# EAGLE board STM32F446 front pane - south - v3 (EAGLE 9.6.2), part 1 of 2
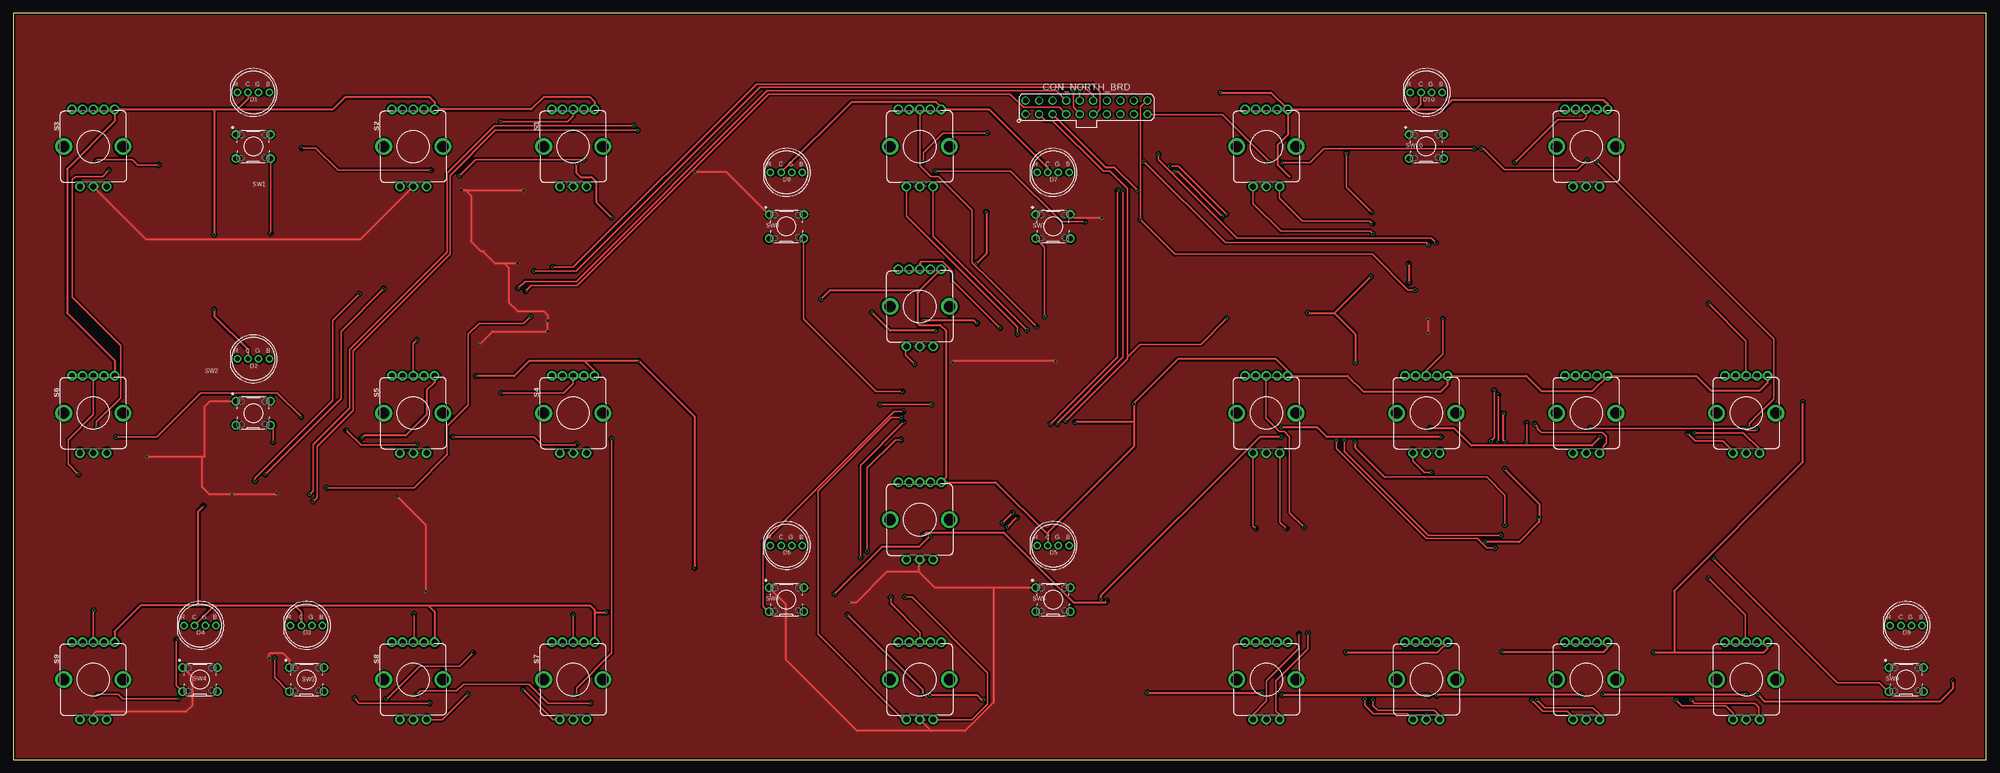
[diagram p9: board, top side]
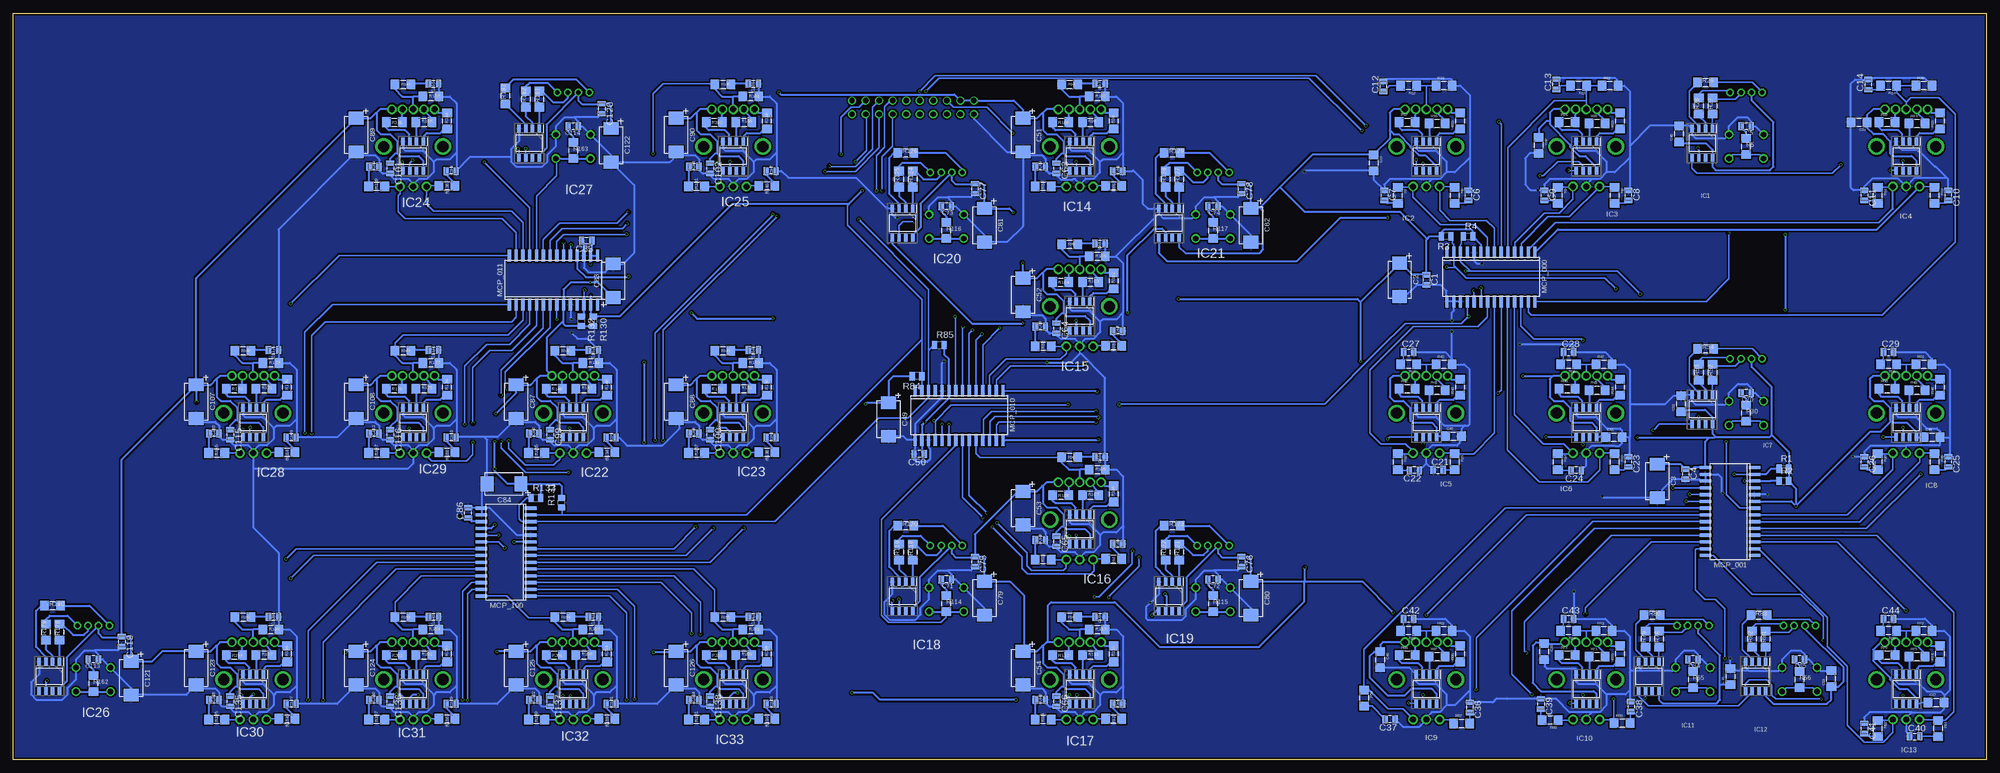
[diagram p10: board, bottom side, seen from below]

Size 370 x 140 mm. Coordinates in mm from the lower left corner, seen from the top.
Outline: 0,0 370,0 370,140 0,140 0,0
Copper layers (1*16): Top 0.035559375mm / dielectric 1.6mm / Bottom 0.035559375mm
Design rules "jlcpcb2layer": minimum track width 5mil, minimum drill 12mil, track to track 5mil, track to pad 5mil, pad to pad 5mil, via to via 5mil, smd to smd 5mil, copper to edge 8mil, drill to drill 6mil, minimum pad ring 5mil, minimum via ring 3mil, stop-mask expansion 2.5mil, vias tented up to drill 0mil, thermal gap 10mil

## Footprints (pad centres in the part's own frame; a part is rotated, then mirrored left to right if it is on the bottom)
0805-CAP = smd 1 x 1.5: 1 -0.95,0; 2 0.95,0
CPOL2917 = smd 2.4 x 2.8: + -3.15,0; - 3.15,0
1206 = smd 1.6 x 1.8: 1 -1.5,0; 2 1.5,0
MA10-2 = drill 1.016: 1 -11.43,-1.27; 2 -11.43,1.27; 3 -8.89,-1.27; 4 -8.89,1.27; 5 -6.35,-1.27; 6 -6.35,1.27; 7 -3.81,-1.27; 8 -3.81,1.27; 9 -1.27,-1.27; 10 -1.27,1.27; 11 1.27,-1.27; 12 1.27,1.27; 13 3.81,-1.27; 14 3.81,1.27; 15 6.35,-1.27; 16 6.35,1.27; 17 8.89,-1.27; 18 8.89,1.27; 19 11.43,-1.27; 20 11.43,1.27
LED4-2.0-D8.0MM = drill 0.85 pad 1.4: 1 3,0; 2 1,0; 3 -1,0; 4 -3,0
SOIC127P600X175-8N = smd 1.528 x 0.65: 1 -2.711,1.905; 2 -2.711,0.635; 3 -2.711,-0.635; 4 -2.711,-1.905; 5 2.711,-1.905; 6 2.711,-0.635; 7 2.711,0.635; 8 2.711,1.905
SOIC-28 = smd 2.2 x 0.6: 1 -4.6,8.255; 2 -4.6,6.985; 3 -4.6,5.715; 4 -4.6,4.445; 5 -4.6,3.175; 6 -4.6,1.905; 7 -4.6,0.635; 8 -4.6,-0.635; 9 -4.6,-1.905; 10 -4.6,-3.175; 11 -4.6,-4.445; 12 -4.6,-5.715; 13 -4.6,-6.985; 14 -4.6,-8.255; 15 4.6,-8.255; 16 4.6,-6.985; 17 4.6,-5.715; 18 4.6,-4.445; 19 4.6,-3.175; 20 4.6,-1.905; 21 4.6,-0.635; 22 4.6,0.635; 23 4.6,1.905; 24 4.6,3.175; 25 4.6,4.445; 26 4.6,5.715; 27 4.6,6.985; 28 4.6,8.255
R0805 = smd 1.016 x 1.422: 1 -0.889,0; 2 0.889,0
ENCODER_LED_3 = drill 1.1 pad 1.778: 1 -4,7; 2 -2,7; 3 0,7; 4 2,7; 5 4,7 | drill 1.1 pad 1.8: A -2.5,-7.5; B 2.5,-7.5; C 0,-7.5 | drill 2.1: M1 -5.55,0; M2 5.55,0
B3F-1000 = drill 1 pad 1.6: 1 -3.25,2.25; 2 3.25,2.25; 3 -3.25,-2.25; 4 3.25,-2.25

## Placement (x,y rotation side)
C1  100n  [0805-CAP]  105,90 270 bottom
C2  10u  [CPOL2917]  110,90 270 bottom
C3  10u  [CPOL2917]  61.69,52.26 270 bottom
C4  100n  [0805-CAP]  56.4,53.53 270 bottom
C5  10n  [0805-CAP]  45,118.81 180 bottom
C6  10n  [0805-CAP]  97.13,105.86 270 bottom
C7  10n  [0805-CAP]  112.87,105.86 270 bottom
C8  10n  [0805-CAP]  67.13,105.86 270 bottom
C9  10n  [0805-CAP]  82.87,105.86 270 bottom
C10  10n  [0805-CAP]  7.13,105.86 270 bottom
C11  10n  [0805-CAP]  22.87,105.86 270 bottom
C12  10n  [0805-CAP]  113.02,126.29 90 bottom
C13  10n  [0805-CAP]  80.63,126.7 90 bottom
C14  10n  [0805-CAP]  22.08,126.63 90 bottom
C15  100n  [1206]  47.98,15.55 90 bottom
C16  100n  [1206]  82.9,20.25 270 bottom
C17  100n  [1206]  9.37,10.72 0 bottom
C18  100n  [1206]  29.05,15.16 90 bottom
C19  100n  [1206]  114.91,111.94 270 bottom
C20  10n  [0805-CAP]  45,68.81 180 bottom
C21  10n  [0805-CAP]  102.77,54.28 0 bottom
C22  10n  [0805-CAP]  107.24,54.28 180 bottom
C23  10n  [0805-CAP]  67.13,55.86 270 bottom
C24  10n  [0805-CAP]  76.88,54.25 180 bottom
C25  10n  [0805-CAP]  7.13,55.86 270 bottom
C26  10n  [0805-CAP]  22.87,55.86 270 bottom
C27  10n  [0805-CAP]  108.3,76.43 0 bottom
C28  10n  [0805-CAP]  78.3,76.43 0 bottom
C29  10n  [0805-CAP]  18.3,76.43 0 bottom
C30  100n  [1206]  99.92,60.63 0 bottom
C31  100n  [1206]  69.82,60.5 0 bottom
C32  100n  [1206]  57.25,66.73 90 bottom
C33  100n  [1206]  23.85,119.56 180 bottom
C34  10n  [0805-CAP]  55,18.81 180 bottom
C35  10n  [0805-CAP]  35,18.81 180 bottom
C36  10n  [0805-CAP]  96.87,9.79 270 bottom
C37  10n  [0805-CAP]  111.77,7.54 180 bottom
C38  10n  [0805-CAP]  66.62,9.92 270 bottom
C39  10n  [0805-CAP]  83.51,10.43 270 bottom
C40  10n  [0805-CAP]  13.4,4.33 0 bottom
C41  10n  [0805-CAP]  22.87,5.86 270 bottom
C42  10n  [0805-CAP]  108.3,26.43 0 bottom
C43  10n  [0805-CAP]  78.3,26.43 0 bottom
C44  10n  [0805-CAP]  18.3,26.43 0 bottom
C45  100n  [1206]  113.64,18.72 270 bottom
C46  100n  [1206]  57.63,117.4 90 bottom
C47  100n  [1206]  83.92,115.24 270 bottom
C48  100n  [1206]  10.13,60.5 0 bottom
C49  10u  [CPOL2917]  205.84,63.81 270 bottom
C50  100n  [0805-CAP]  200.12,57.33 180 bottom
C51  10u  [CPOL2917]  180.67,117.16 270 bottom
C52  10u  [CPOL2917]  180.67,87.16 270 bottom
C53  10u  [CPOL2917]  180.67,47.16 270 bottom
C54  10u  [CPOL2917]  180.67,17.16 270 bottom
C55  10n  [0805-CAP]  162.89,110.43 180 bottom
C56  10n  [0805-CAP]  177.37,111.19 180 bottom
C57  10n  [0805-CAP]  162.89,80.43 180 bottom
C58  10n  [0805-CAP]  177.37,81.19 180 bottom
C59  10n  [0805-CAP]  162.89,40.43 180 bottom
C60  10n  [0805-CAP]  177.37,41.19 180 bottom
C61  10n  [0805-CAP]  162.89,10.43 180 bottom
C62  10n  [0805-CAP]  177.37,11.19 180 bottom
C63  100n  [0805-CAP]  174.32,110.94 270 bottom
C64  100n  [0805-CAP]  174.32,80.94 270 bottom
C65  100n  [0805-CAP]  174.32,40.94 270 bottom
C66  100n  [0805-CAP]  174.32,10.94 270 bottom
C67  10n  [0805-CAP]  166.19,126.81 0 bottom
C68  10n  [0805-CAP]  166.19,96.81 0 bottom
C69  10n  [0805-CAP]  166.19,56.81 0 bottom
C70  10n  [0805-CAP]  166.19,26.81 0 bottom
C71  10n  [0805-CAP]  195,33.81 180 bottom
C72  10n  [0805-CAP]  145,33.81 180 bottom
C73  10n  [0805-CAP]  195,103.81 180 bottom
C74  10n  [0805-CAP]  145,103.81 180 bottom
C75  100n  [0805-CAP]  189.67,37.11 270 bottom
C76  100n  [0805-CAP]  139.67,37.11 270 bottom
C77  100n  [0805-CAP]  189.67,107.11 270 bottom
C78  100n  [0805-CAP]  139.67,107.11 270 bottom
C79  10u  [CPOL2917]  187.89,30.25 270 bottom
C80  10u  [CPOL2917]  137.89,30.25 270 bottom
C81  10u  [CPOL2917]  187.89,100.25 270 bottom
C82  10u  [CPOL2917]  137.89,100.25 270 bottom
C83  10u  [CPOL2917]  257.53,89.84 90 bottom
C84  10u  [CPOL2917]  277.98,51.74 180 bottom
C85  100n  [0805-CAP]  262.48,97.33 180 bottom
C86  100n  [0805-CAP]  284.71,46.28 90 bottom
C87  10u  [CPOL2917]  275.67,67.16 270 bottom
C88  10u  [CPOL2917]  245.67,67.16 270 bottom
C89  10u  [CPOL2917]  305.67,117.16 270 bottom
C90  10u  [CPOL2917]  245.67,117.16 270 bottom
C91  10n  [0805-CAP]  257.89,60.43 180 bottom
C92  10n  [0805-CAP]  272.37,61.19 180 bottom
C93  10n  [0805-CAP]  227.89,60.43 180 bottom
C94  10n  [0805-CAP]  242.37,61.19 180 bottom
C95  10n  [0805-CAP]  287.89,110.43 180 bottom
C96  10n  [0805-CAP]  302.37,111.19 180 bottom
C97  10n  [0805-CAP]  227.89,110.43 180 bottom
C98  10n  [0805-CAP]  242.37,111.19 180 bottom
C99  100n  [0805-CAP]  269.32,60.94 270 bottom
C100  100n  [0805-CAP]  239.32,60.94 270 bottom
C101  100n  [0805-CAP]  299.32,110.94 270 bottom
C102  100n  [0805-CAP]  239.32,110.94 270 bottom
C103  10n  [0805-CAP]  261.19,76.81 0 bottom
C104  10n  [0805-CAP]  231.19,76.81 0 bottom
C105  10n  [0805-CAP]  291.19,126.81 0 bottom
C106  10n  [0805-CAP]  231.19,126.81 0 bottom
C107  10u  [CPOL2917]  335.67,67.16 270 bottom
C108  10u  [CPOL2917]  305.67,67.16 270 bottom
C109  10n  [0805-CAP]  317.89,60.43 180 bottom
C110  10n  [0805-CAP]  332.37,61.19 180 bottom
C111  10n  [0805-CAP]  287.89,60.43 180 bottom
C112  10n  [0805-CAP]  302.37,61.19 180 bottom
C113  10n  [0805-CAP]  355,18.81 180 bottom
C114  10n  [0805-CAP]  265,118.81 180 bottom
C115  100n  [0805-CAP]  329.32,60.94 270 bottom
C116  100n  [0805-CAP]  299.32,60.94 270 bottom
C117  10n  [0805-CAP]  321.19,76.81 0 bottom
C118  10n  [0805-CAP]  291.19,76.81 0 bottom
C119  100n  [0805-CAP]  349.67,22.11 270 bottom
C120  100n  [0805-CAP]  259.67,122.11 270 bottom
C121  10u  [CPOL2917]  347.89,15.25 270 bottom
C122  10u  [CPOL2917]  257.89,115.25 270 bottom
C123  10u  [CPOL2917]  335.67,17.16 270 bottom
C124  10u  [CPOL2917]  305.67,17.16 270 bottom
C125  10u  [CPOL2917]  275.67,17.16 270 bottom
C126  10u  [CPOL2917]  245.67,17.16 270 bottom
C127  10n  [0805-CAP]  317.89,10.43 180 bottom
C128  10n  [0805-CAP]  332.37,11.19 180 bottom
C129  10n  [0805-CAP]  287.89,10.43 180 bottom
C130  10n  [0805-CAP]  302.37,11.19 180 bottom
C131  10n  [0805-CAP]  257.89,10.43 180 bottom
C132  10n  [0805-CAP]  272.37,11.19 180 bottom
C133  10n  [0805-CAP]  227.89,10.43 180 bottom
C134  10n  [0805-CAP]  242.37,11.19 180 bottom
C135  100n  [0805-CAP]  329.32,10.94 270 bottom
C136  100n  [0805-CAP]  299.32,10.94 270 bottom
C137  100n  [0805-CAP]  269.32,10.94 270 bottom
C138  100n  [0805-CAP]  239.32,10.94 270 bottom
C139  10n  [0805-CAP]  321.19,26.81 0 bottom
C140  10n  [0805-CAP]  291.19,26.81 0 bottom
C141  10n  [0805-CAP]  261.19,26.81 0 bottom
C142  10n  [0805-CAP]  231.19,26.81 0 bottom
CON_NORTH_BRD  [MA10-2]  201.27,122.35 0 top
D1  CZXR-80RGB03-A  [LED4-2.0-D8.0MM]  45,125.16 180 top
D2  CZXR-80RGB03-A  [LED4-2.0-D8.0MM]  45,75.16 180 top
D3  CZXR-80RGB03-A  [LED4-2.0-D8.0MM]  55,25.16 180 top
D4  CZXR-80RGB03-A  [LED4-2.0-D8.0MM]  35,25.16 180 top
D5  CZXR-80RGB03-A  [LED4-2.0-D8.0MM]  195,40.16 180 top
D6  CZXR-80RGB03-A  [LED4-2.0-D8.0MM]  145,40.16 180 top
D7  CZXR-80RGB03-A  [LED4-2.0-D8.0MM]  195,110.16 180 top
D8  CZXR-80RGB03-A  [LED4-2.0-D8.0MM]  145,110.16 180 top
D9  CZXR-80RGB03-A  [LED4-2.0-D8.0MM]  355,25.16 180 top
D10  CZXR-80RGB03-A  [LED4-2.0-D8.0MM]  265,125.16 180 top
IC1  NEOPIXEL-TLC59731DR  [SOIC127P600X175-8N]  53.26,115.64 270 bottom
IC2  NEOPIXEL-TLC59731DR  [SOIC127P600X175-8N]  105,113.22 270 bottom
IC3  NEOPIXEL-TLC59731DR  [SOIC127P600X175-8N]  75,113.22 270 bottom
IC4  NEOPIXEL-TLC59731DR  [SOIC127P600X175-8N]  15,113.22 270 bottom
IC5  NEOPIXEL-TLC59731DR  [SOIC127P600X175-8N]  105,63.22 270 bottom
IC6  NEOPIXEL-TLC59731DR  [SOIC127P600X175-8N]  75,63.22 270 bottom
IC7  NEOPIXEL-TLC59731DR  [SOIC127P600X175-8N]  53.26,65.64 270 bottom
IC8  NEOPIXEL-TLC59731DR  [SOIC127P600X175-8N]  15,63.22 270 bottom
IC9  NEOPIXEL-TLC59731DR  [SOIC127P600X175-8N]  105,13.22 270 bottom
IC10  NEOPIXEL-TLC59731DR  [SOIC127P600X175-8N]  75,13.22 270 bottom
IC11  NEOPIXEL-TLC59731DR  [SOIC127P600X175-8N]  63.26,15.63 270 bottom
IC12  NEOPIXEL-TLC59731DR  [SOIC127P600X175-8N]  43.26,15.63 270 bottom
IC13  NEOPIXEL-TLC59731DR  [SOIC127P600X175-8N]  15,13.22 270 bottom
IC14  NEOPIXEL-TLC59731DR  [SOIC127P600X175-8N]  170,113.22 270 bottom
IC15  NEOPIXEL-TLC59731DR  [SOIC127P600X175-8N]  170,83.22 270 bottom
IC16  NEOPIXEL-TLC59731DR  [SOIC127P600X175-8N]  170,43.22 270 bottom
IC17  NEOPIXEL-TLC59731DR  [SOIC127P600X175-8N]  170,13.22 270 bottom
IC18  NEOPIXEL-TLC59731DR  [SOIC127P600X175-8N]  203.25,30.64 270 bottom
IC19  NEOPIXEL-TLC59731DR  [SOIC127P600X175-8N]  153.25,30.64 270 bottom
IC20  NEOPIXEL-TLC59731DR  [SOIC127P600X175-8N]  203.25,100.64 270 bottom
IC21  NEOPIXEL-TLC59731DR  [SOIC127P600X175-8N]  153.25,100.64 270 bottom
IC22  NEOPIXEL-TLC59731DR  [SOIC127P600X175-8N]  265,63.22 270 bottom
IC23  NEOPIXEL-TLC59731DR  [SOIC127P600X175-8N]  235,63.22 270 bottom
IC24  NEOPIXEL-TLC59731DR  [SOIC127P600X175-8N]  295,113.22 270 bottom
IC25  NEOPIXEL-TLC59731DR  [SOIC127P600X175-8N]  235,113.22 270 bottom
IC26  NEOPIXEL-TLC59731DR  [SOIC127P600X175-8N]  363.25,15.63 270 bottom
IC27  NEOPIXEL-TLC59731DR  [SOIC127P600X175-8N]  273.25,115.64 270 bottom
IC28  NEOPIXEL-TLC59731DR  [SOIC127P600X175-8N]  325,63.22 270 bottom
IC29  NEOPIXEL-TLC59731DR  [SOIC127P600X175-8N]  295,63.22 270 bottom
IC30  NEOPIXEL-TLC59731DR  [SOIC127P600X175-8N]  325,13.22 270 bottom
IC31  NEOPIXEL-TLC59731DR  [SOIC127P600X175-8N]  295,13.22 270 bottom
IC32  NEOPIXEL-TLC59731DR  [SOIC127P600X175-8N]  265,13.22 270 bottom
IC33  NEOPIXEL-TLC59731DR  [SOIC127P600X175-8N]  235,13.22 270 bottom
MCP_000  MCP23017  [SOIC-28]  92.87,90.54 270 bottom
MCP_001  MCP23017  [SOIC-28]  48.05,46.52 180 bottom
MCP_010  MCP23017  [SOIC-28]  192.63,64.57 270 bottom
MCP_011  MCP23017  [SOIC-28]  268.7,89.97 90 bottom
MCP_100  MCP23017  [SOIC-28]  277.59,38.91 180 bottom
R1  1k  [R0805]  37.95,54.53 0 bottom
R2  1k  [R0805]  37.95,52.25 0 bottom
R3  1k  [R0805]  101.25,98.16 180 bottom
R4  1k  [R0805]  97.19,98.16 0 bottom
R5  470  [1206]  45,115 90 bottom
R6  470  [1206]  99.67,105.86 270 bottom
R7  470  [1206]  110.33,105.86 270 bottom
R8  470  [1206]  69.67,105.86 270 bottom
R9  470  [1206]  80.33,105.86 270 bottom
R10  470  [1206]  9.67,105.86 270 bottom
R11  470  [1206]  20.33,105.86 270 bottom
R12  470  [1206]  108.3,126.43 180 bottom
R13  470  [1206]  76.4,126.43 180 bottom
R14  470  [1206]  18.3,126.43 180 bottom
R15  100  [1206]  98.65,119.83 90 bottom
R16  100  [1206]  102.97,119.32 0 bottom
R17  100  [1206]  108.56,119.57 0 bottom
R18  10k  [1206]  101.7,126.43 0 bottom
R19  100  [1206]  68.65,119.83 90 bottom
R20  100  [1206]  72.97,119.32 0 bottom
R21  100  [1206]  78.56,119.57 0 bottom
R22  10k  [1206]  70.56,126.43 0 bottom
R23  100  [1206]  8.65,119.83 90 bottom
R24  100  [1206]  12.97,119.32 0 bottom
R25  100  [1206]  18.56,119.57 0 bottom
R26  10k  [1206]  11.7,126.43 0 bottom
R27  100  [1206]  51.35,122.62 90 bottom
R28  100  [1206]  53.89,122.62 90 bottom
R29  100  [1206]  52.62,127.06 0 bottom
R30  470  [1206]  45,65 90 bottom
R31  470  [1206]  99.67,55.86 270 bottom
R32  470  [1206]  110.33,55.86 270 bottom
R33  470  [1206]  69.67,55.86 270 bottom
R34  470  [1206]  80.33,55.86 270 bottom
R35  470  [1206]  9.67,55.86 270 bottom
R36  470  [1206]  20.33,55.86 270 bottom
R37  470  [1206]  108.3,74.14 180 bottom
R38  470  [1206]  78.3,74.14 180 bottom
R39  470  [1206]  18.3,74.14 180 bottom
R40  100  [1206]  98.65,69.83 90 bottom
R41  100  [1206]  102.97,69.32 0 bottom
R42  100  [1206]  108.56,69.57 0 bottom
R43  10k  [1206]  101.7,74.14 0 bottom
R44  100  [1206]  68.65,69.83 90 bottom
R45  100  [1206]  72.97,69.32 0 bottom
R46  100  [1206]  78.56,69.57 0 bottom
R47  10k  [1206]  71.7,74.14 0 bottom
R48  100  [1206]  8.65,69.83 90 bottom
R49  100  [1206]  12.97,69.32 0 bottom
R50  100  [1206]  18.56,69.57 0 bottom
R51  10k  [1206]  11.7,74.14 0 bottom
R52  100  [1206]  51.35,72.62 90 bottom
R53  100  [1206]  53.89,72.62 90 bottom
R54  100  [1206]  52.62,77.06 0 bottom
R55  470  [1206]  55,15 90 bottom
R56  470  [1206]  35,15 90 bottom
R57  470  [1206]  98.36,6.78 0 bottom
R58  470  [1206]  116.68,11.57 270 bottom
R59  470  [1206]  68.26,6.81 0 bottom
R60  470  [1206]  81.8,7.39 180 bottom
R61  470  [1206]  9.03,5.86 270 bottom
R62  470  [1206]  20.33,5.86 270 bottom
R63  470  [1206]  108.3,24.14 180 bottom
R64  470  [1206]  78.3,24.14 180 bottom
R65  470  [1206]  18.3,24.14 180 bottom
R66  100  [1206]  98.65,19.83 90 bottom
R67  100  [1206]  102.97,19.32 0 bottom
R68  100  [1206]  108.56,19.57 0 bottom
R69  10k  [1206]  101.7,24.14 0 bottom
R70  100  [1206]  68.65,19.83 90 bottom
R71  100  [1206]  72.97,19.32 0 bottom
R72  100  [1206]  78.56,19.57 0 bottom
R73  10k  [1206]  71.7,24.14 0 bottom
R74  100  [1206]  8.65,19.83 90 bottom
R75  100  [1206]  12.97,19.32 0 bottom
R76  100  [1206]  18.56,19.57 0 bottom
R77  10k  [1206]  11.7,24.14 0 bottom
R78  100  [1206]  61.35,22.62 90 bottom
R79  100  [1206]  63.89,22.62 90 bottom
R80  100  [1206]  62.62,27.07 0 bottom
R81  100  [1206]  41.35,22.62 90 bottom
R82  100  [1206]  43.89,22.62 90 bottom
R83  100  [1206]  42.62,27.07 0 bottom
R84  1k  [R0805]  200.5,71.93 180 bottom
R85  1k  [R0805]  196.31,77.78 0 bottom
R86  470  [1206]  163.65,107.63 0 bottom
R87  470  [1206]  176.86,107.51 180 bottom
R88  470  [1206]  163.65,77.63 0 bottom
R89  470  [1206]  176.86,77.51 180 bottom
R90  470  [1206]  163.65,37.63 0 bottom
R91  470  [1206]  176.86,37.51 180 bottom
R92  470  [1206]  163.65,7.63 0 bottom
R93  470  [1206]  176.86,7.51 180 bottom
R94  470  [1206]  171.91,126.68 0 bottom
R95  470  [1206]  171.91,96.68 0 bottom
R96  470  [1206]  171.91,56.68 0 bottom
R97  470  [1206]  171.91,26.68 0 bottom
R98  100  [1206]  163.65,119.83 90 bottom
R99  100  [1206]  167.97,119.57 0 bottom
R100  100  [1206]  173.56,119.57 0 bottom
R101  10k  [1206]  166.7,124.4 0 bottom
R102  100  [1206]  163.65,89.83 90 bottom
R103  100  [1206]  167.97,89.57 0 bottom
R104  100  [1206]  173.56,89.57 0 bottom
R105  10k  [1206]  166.7,94.4 0 bottom
R106  100  [1206]  163.65,49.83 90 bottom
R107  100  [1206]  167.97,49.57 0 bottom
R108  100  [1206]  173.56,49.57 0 bottom
R109  10k  [1206]  166.7,54.4 0 bottom
R110  100  [1206]  163.65,19.83 90 bottom
R111  100  [1206]  167.97,19.57 0 bottom
R112  100  [1206]  173.56,19.57 0 bottom
R113  10k  [1206]  166.7,24.4 0 bottom
R114  470  [1206]  195,29.24 90 bottom
R115  470  [1206]  145,29.24 90 bottom
R116  470  [1206]  195,99.24 90 bottom
R117  470  [1206]  145,99.24 90 bottom
R118  100  [1206]  201.35,38.89 90 bottom
R119  100  [1206]  203.89,38.89 90 bottom
R120  100  [1206]  202.62,43.84 0 bottom
R121  100  [1206]  151.35,38.89 90 bottom
R122  100  [1206]  153.89,38.89 90 bottom
R123  100  [1206]  152.62,43.84 0 bottom
R124  100  [1206]  201.35,108.89 90 bottom
R125  100  [1206]  203.89,108.89 90 bottom
R126  100  [1206]  202.62,113.84 0 bottom
R127  100  [1206]  151.35,108.89 90 bottom
R128  100  [1206]  153.89,108.89 90 bottom
R129  100  [1206]  152.62,113.84 0 bottom
R130  1k  [R0805]  261.21,82.22 270 bottom
R131  1k  [R0805]  267.18,48.19 90 bottom
R132  1k  [R0805]  263.5,82.22 270 bottom
R133  1k  [R0805]  272.01,49.07 0 bottom
R134  470  [1206]  258.65,57.63 0 bottom
R135  470  [1206]  271.86,57.51 180 bottom
R136  470  [1206]  228.65,57.63 0 bottom
R137  470  [1206]  241.86,57.51 180 bottom
R138  470  [1206]  288.65,107.63 0 bottom
R139  470  [1206]  301.86,107.51 180 bottom
R140  470  [1206]  228.65,107.63 0 bottom
R141  470  [1206]  241.86,107.51 180 bottom
R142  470  [1206]  266.9,76.68 0 bottom
R143  470  [1206]  236.91,76.68 0 bottom
R144  470  [1206]  296.9,126.68 0 bottom
R145  470  [1206]  236.91,126.68 0 bottom
R146  100  [1206]  258.65,69.83 90 bottom
R147  100  [1206]  262.97,69.57 0 bottom
R148  100  [1206]  268.56,69.57 0 bottom
R149  10k  [1206]  261.7,74.4 0 bottom
R150  100  [1206]  228.65,69.83 90 bottom
R151  100  [1206]  232.97,69.57 0 bottom
R152  100  [1206]  238.56,69.57 0 bottom
R153  10k  [1206]  231.7,74.4 0 bottom
R154  100  [1206]  288.65,119.83 90 bottom
R155  100  [1206]  292.97,119.57 0 bottom
R156  100  [1206]  298.56,119.57 0 bottom
R157  10k  [1206]  291.7,124.4 0 bottom
R158  100  [1206]  228.65,119.83 90 bottom
R159  100  [1206]  232.97,119.57 0 bottom
R160  100  [1206]  238.56,119.57 0 bottom
R161  10k  [1206]  231.7,124.4 0 bottom
R162  470  [1206]  355,14.24 90 bottom
R163  470  [1206]  265,114.24 90 bottom
R164  470  [1206]  318.65,57.63 0 bottom
R165  470  [1206]  331.86,57.51 180 bottom
R166  470  [1206]  288.65,57.63 0 bottom
R167  470  [1206]  301.86,57.51 180 bottom
R168  470  [1206]  326.9,76.68 0 bottom
R169  470  [1206]  296.9,76.68 0 bottom
R170  100  [1206]  318.65,69.83 90 bottom
R171  100  [1206]  322.97,69.57 0 bottom
R172  100  [1206]  328.56,69.57 0 bottom
R173  10k  [1206]  321.7,74.4 0 bottom
R174  100  [1206]  288.65,69.83 90 bottom
R175  100  [1206]  292.97,69.57 0 bottom
R176  100  [1206]  298.56,69.57 0 bottom
R177  10k  [1206]  291.7,74.4 0 bottom
R178  100  [1206]  361.35,23.89 90 bottom
R179  100  [1206]  363.89,23.89 90 bottom
R180  100  [1206]  362.62,28.84 0 bottom
R181  100  [1206]  271.35,123.89 90 bottom
R182  100  [1206]  273.89,123.89 90 bottom
R183  100  [1206]  277.73,124.53 90 bottom
R184  470  [1206]  318.65,7.63 0 bottom
R185  470  [1206]  331.86,7.51 180 bottom
R186  470  [1206]  288.65,7.63 0 bottom
R187  470  [1206]  301.86,7.51 180 bottom
R188  470  [1206]  258.65,7.63 0 bottom
R189  470  [1206]  271.86,7.51 180 bottom
R190  470  [1206]  228.65,7.63 0 bottom
R191  470  [1206]  241.86,7.51 180 bottom
R192  470  [1206]  326.9,26.68 0 bottom
R193  470  [1206]  296.9,26.68 0 bottom
R194  470  [1206]  266.9,26.68 0 bottom
R195  470  [1206]  236.91,26.68 0 bottom
R196  100  [1206]  318.65,19.83 90 bottom
R197  100  [1206]  322.97,19.57 0 bottom
R198  100  [1206]  328.56,19.57 0 bottom
R199  10k  [1206]  321.7,24.4 0 bottom
R200  100  [1206]  288.65,19.83 90 bottom
R201  100  [1206]  292.97,19.57 0 bottom
R202  100  [1206]  298.56,19.57 0 bottom
R203  10k  [1206]  291.7,24.4 0 bottom
R204  100  [1206]  258.65,19.83 90 bottom
R205  100  [1206]  262.97,19.57 0 bottom
R206  100  [1206]  268.56,19.57 0 bottom
R207  10k  [1206]  261.7,24.4 0 bottom
R208  100  [1206]  228.65,19.83 90 bottom
R209  100  [1206]  232.97,19.57 0 bottom
R210  100  [1206]  238.56,19.57 0 bottom
R211  10k  [1206]  231.7,24.4 0 bottom
S1  [ENCODER_LED_3]  105,115 0 top
S2  [ENCODER_LED_3]  75,115 0 top
S3  [ENCODER_LED_3]  15,115 0 top
S4  [ENCODER_LED_3]  105,65 0 top
S5  [ENCODER_LED_3]  75,65 0 top
S6  [ENCODER_LED_3]  15,65 0 top
S7  [ENCODER_LED_3]  105,15 0 top
S8  [ENCODER_LED_3]  75,15 0 top
S9  [ENCODER_LED_3]  15,15 0 top
S10  [ENCODER_LED_3]  170,115 0 top
S11  [ENCODER_LED_3]  170,85 0 top
S12  [ENCODER_LED_3]  170,45 0 top
S13  [ENCODER_LED_3]  170,15 0 top
S14  [ENCODER_LED_3]  265,65 0 top
S15  [ENCODER_LED_3]  235,65 0 top
S16  [ENCODER_LED_3]  295,115 0 top
S17  [ENCODER_LED_3]  235,115 0 top
S18  [ENCODER_LED_3]  325,65 0 top
S19  [ENCODER_LED_3]  295,65 0 top
S20  [ENCODER_LED_3]  325,15 0 top
S21  [ENCODER_LED_3]  295,15 0 top
S22  [ENCODER_LED_3]  265,15 0 top
S23  [ENCODER_LED_3]  235,15 0 top
SW1  B3F-1000  [B3F-1000]  45,115 0 top
SW2  B3F-1000  [B3F-1000]  45,65 0 top
SW3  B3F-1000  [B3F-1000]  55,15 0 top
SW4  B3F-1000  [B3F-1000]  35,15 0 top
SW5  B3F-1000  [B3F-1000]  195,30 0 top
SW6  B3F-1000  [B3F-1000]  145,30 0 top
SW7  B3F-1000  [B3F-1000]  195,100 0 top
SW8  B3F-1000  [B3F-1000]  145,100 0 top
SW9  B3F-1000  [B3F-1000]  355,15 0 top
SW10  B3F-1000  [B3F-1000]  265,115 0 top

## Tracks (layer width: path | path; a pad name or v marks a point on that pad's centre or on a via)
3V3  (via drill 0.35)
  Top 0.406: S5.5 79,70.78 77.54,69.32 77.54,64.75 73.55,60.76 65.76,60.76 v65.38,60.38 | D1.2 44,123.96 42.04,122 | 37.69,122 S3.5 19,119.72 10.08,110.8 10.08,83.8 19,74.88 S6.5 | 37.69,122 42.04,122 | 42.04,122 59.94,122 62.2,124.26 78.08,124.26 79,123.33 S2.5 97.16,122 99.41,124.26 108.18,124.26 109,123.43 S1.5 | 107.16,74.73 96.75,74.73 93.95,71.93 v86.84,71.93 | 107.16,74.73 109,72.89 S4.5 | 107.16,74.73 v117.32,74.73 127.73,64.31 v127.73,35.99 | D4.2 37.72,28.88 | D3.2 54,27.68 52.8,28.88 | 37.72,28.88 52.8,28.88 | 37.72,28.88 34.64,28.88 | 34.64,28.88 23.85,28.88 19,24.03 S9.5 | 52.8,28.88 77.82,28.88 | S8.5 79,27.7 77.82,28.88 | 77.82,28.88 108.18,28.88 109,28.06 109,27.48 | 109,27.48 S7.5 | 34.64,28.88 34.64,46.53 v35.66,47.55 | v249.91,20.12 267.12,20.12 S22.5 | v279.25,20.25 298.3,20.25 299,20.95 S21.5 | v307.69,20.12 311.5,20.12 | 311.5,20.12 328.27,20.12 329,20.85 S20.5 | S18.5 329,70.76 327.5,69.27 318.36,69.27 315.63,72 S19.5 296.14,69.14 286.61,69.14 283.75,72 S14.5 269,70.33 267.69,69.01 253.21,69.01 250.22,72 S15.5 239,72.89 236.78,75.11 218.41,75.11 210.16,66.85 v210.16,66.73 210.16,63.3 | S17.5 263.02,122 | D10.2 264,122.98 263.02,122 | 263.02,122 268.07,122 269.82,123.75 298.3,123.75 299,123.05 S16.5 | D7.2 194,110.95 182.95,122 S10.5 174,122.44 173.07,123.37 157.21,123.37 D8.2 | 194,42.24 D5.2 | 194,42.24 184.24,52 S12.5 174.89,52.89 174.89,80.48 173.83,81.54 169.86,81.54 169.56,81.85 169.56,87.56 169.98,87.98 | v182.47,102.67 182.47,94.92 v180.69,93.14 | S11.5 169.98,87.98 | S17.5 239,117.19 237.21,115.4 237.21,111.55 239.37,109.39 | v335.63,67.11 335.63,55.8 311.5,31.68 311.5,20.12
  Top 0.406: 210.16,63.3 210.16,58.73 194,42.57 194,42.24 | v261.78,89.52 261.78,92.95 v261.72,93.02 | v279.75,54.53 279.75,54.41 286.23,47.93 v286.23,45.39 286.23,44.63 282.42,40.82 v276.07,40.82 | v279.75,59.62 279.5,59.87 v279.5,64.95 | 210.16,63.3 v199.11,63.3 | v226.41,125.15 235.85,125.15 S17.5 | v111.22,27.61 111.1,27.48 109,27.48 | 37.69,122 v37.69,98.48 | v37.69,84.38 37.69,83.24 44,76.93 D2.2 | 169.98,87.98 153.05,87.98 v151.48,86.41
  Bottom 0.406: MCP_000.9 94.77,96.64 R4.2 96.3,99.18 96.53,99.41 101.66,99.41 102.14,98.92 R3.2 104.3,98.16 104.81,97.65 | S3.5 21.21,122 22.35,120.86 C33.1 22.35,118.54 21.1,117.29 19.32,117.29 18.05,116.02 18.05,113.73 17.54,113.22 13.98,113.22 13.1,112.33 IC4.8 | S2.5 81.21,122 81.86,121.35 81.86,119.81 | S1.5 111.21,122 111.86,121.35 111.86,118.05 | 111.86,118.05 111.1,117.29 110.17,117.29 108.05,115.17 108.05,115.01 106.39,113.35 105.14,113.35 103.09,111.31 IC2.8 | S6.5 21.21,72 21.86,71.35 21.86,68.05 21.1,67.29 19.32,67.29 18.05,66.02 18.05,63.73 17.79,63.48 | 17.79,63.48 17.54,63.22 14.88,63.22 13.1,61.43 IC8.8 11.64,60.51 C48.1 | S5.5 81.21,72 81.45,71.75 | 81.45,71.75 81.86,71.35 81.86,68.05 81.1,67.29 79.32,67.29 78.05,66.02 78.05,63.73 77.54,63.22 73.98,63.22 73.09,62.33 IC6.8 71.33,60.51 C31.1 | S4.5 111.21,72 111.86,71.35 111.86,68.05 111.1,67.29 109.32,67.29 108.05,66.02 108.05,63.73 107.54,63.22 103.98,63.22 103.09,62.33 IC5.8 102.97,60.63 C30.1 | IC10.8 73.09,12.33 73.6,12.84 83.51,12.84 85.03,14.37 85.03,21.35 84.38,22 83.16,22 C16.1 79.25,21.75 S8.5 | IC9.8 103.09,12.33 103.98,13.22 107.83,13.22 109.06,11.99 112.24,11.99 115.54,15.29 115.54,19.48 114.78,20.25 113.66,20.25 C45.1 113.64,21.52 113.15,22 S7.5 | D1.2 44,123.64 39.92,119.56 39.92,111.19 40.55,110.56 50.72,110.56 51.35,111.19 IC1.8 51.35,114.42 52.55,115.62 57.35,115.62 C46.1 | D2.2 44,73.64 40.23,69.86 40.23,60.88 | 50.72,60.55 51.35,61.19 IC7.8 51.35,64.26 52.7,65.61 56.87,65.61 C32.1 | 50.72,60.55 40.55,60.55 40.23,60.88 | D3.2 54,23.64 49.92,19.55 49.92,13.89
  Bottom 0.406: 61.35,13.36 IC11.8 61.35,11.19 60.72,10.55 50.55,10.55 49.92,11.19 49.92,13.89 | D4.2 34,24.52 26.75,17.27 26.75,14.66 27.74,13.66 C18.1 29.05,11.22 29.85,10.43 39.92,10.43 41.35,11.86 IC12.8 41.35,13.36 | 104.81,97.65 105,97.46 C1.1 107.6,90.95 109.8,93.15 C2.+ 117.32,85.83 | v65.38,60.38 51.91,60.38 | 51.91,60.38 50.89,60.38 50.72,60.55 | C15.1 49.77,14.05 49.92,13.89 | 51.91,60.38 52.65,59.64 MCP_001.15 54.84,54.78 55.15,54.48 C4.1 57.33,55.41 C3.+ | 17.79,63.48 19.75,61.52 21.69,61.52 v35.66,47.55 | v86.84,71.93 81.63,71.93 81.45,71.75 | C17.1 12.16,10.72 12.37,10.51 IC13.8 13.1,11.56 14.76,13.22 16.26,13.22 18.05,15.01 18.05,15.4 21.19,18.54 21.19,20.61 19.8,22 S9.5 | C47.1 83.79,116.87 83.79,118.42 82.39,119.81 81.86,119.81 | 111.86,118.05 111.86,116.49 C19.1 126.36,113.44 132.43,107.37 | S10.5 176.21,122 176.86,121.35 | 176.86,121.35 176.86,118.05 176.1,117.29 174.32,117.29 173.05,116.02 173.05,113.73 | 173.05,113.73 172.54,113.22 168.98,113.22 168.09,112.33 IC14.8 | C63.1 174.32,112.71 173.3,113.73 173.05,113.73 | 176.86,121.35 176.99,121.35 178.03,120.31 C51.+ 180.67,121.95 182.34,123.62 CON_NORTH_BRD.2 CON_NORTH_BRD.4 193.52,124.77 199.77,124.77 199.82,124.72 225.98,124.72 v226.41,125.15 | S11.5 176.21,92 176.86,91.35 | 176.86,91.35 176.86,88.05 176.1,87.29 174.32,87.29 173.05,86.02 173.05,83.73 | 173.05,83.73 172.54,83.22 168.98,83.22 168.09,82.33 IC15.8 | C64.1 174.32,82.71 173.3,83.73 173.05,83.73 | 176.86,91.35 176.99,91.35 178.03,90.31 C52.+ 180.69,90.33 v180.69,93.14 | S12.5 176.21,52 176.86,51.35 | 176.86,51.35 176.86,48.05 176.1,47.29 174.32,47.29 173.05,46.02 173.05,43.73
  Bottom 0.406: 173.05,43.73 172.54,43.22 168.98,43.22 168.09,42.33 IC16.8 | C65.1 174.32,42.71 173.3,43.73 173.05,43.73 | 176.86,51.35 176.99,51.35 178.03,50.31 C53.+ 181.62,50.31 189.67,42.26 C75.1 | S13.5 176.21,22 | 176.86,21.35 176.86,18.05 176.1,17.29 174.32,17.29 173.05,16.02 173.05,13.73 | 173.05,13.73 172.54,13.22 168.98,13.22 168.09,12.33 IC17.8 | 176.86,21.35 176.21,22 | C66.1 174.32,12.71 173.3,13.73 173.05,13.73 | C54.+ 180.44,20.31 | 180.44,20.31 178.03,20.31 176.99,21.35 176.86,21.35 | S17.5 241.21,122 241.86,121.35 | 241.86,121.35 241.86,118.05 241.1,117.29 239.32,117.29 238.05,116.02 238.05,113.73 | 238.05,113.73 237.54,113.22 233.98,113.22 233.09,112.33 IC25.8 | C102.1 239.32,112.71 238.3,113.73 238.05,113.73 | C90.+ 243.03,120.31 241.99,121.35 241.86,121.35 | S16.5 301.21,122 301.86,121.35 | 301.86,121.35 301.86,118.05 301.1,117.29 299.32,117.29 298.05,116.02 298.05,113.73 | 298.05,113.73 297.54,113.22 293.98,113.22 293.1,112.33 IC24.8 | C101.1 299.32,112.71 298.3,113.73 298.05,113.73 | 301.86,121.35 301.99,121.35 303.03,120.31 C89.+ 335.67,90.31 C107.+ | S15.5 241.21,72 241.86,71.35 | 241.86,71.35 241.86,68.05 241.1,67.29 239.32,67.29 238.05,66.02 238.05,63.73 | 238.05,63.73 237.54,63.22 233.98,63.22 233.09,62.33 IC23.8 | C100.1 239.32,62.71 238.3,63.73 238.05,63.73 | C88.+ 243.03,70.31 241.99,71.35 241.86,71.35 | 271.86,71.35 271.86,68.05 271.1,67.29 269.32,67.29 268.05,66.02 268.05,63.73 | 268.05,63.73 267.54,63.22 263.98,63.22 263.1,62.33 IC22.8 | 271.86,71.35 271.21,72 S14.5 269.97,72.97 269.97,79.17 266.8,82.35 | C99.1 269.32,62.71 268.3,63.73 268.05,63.73
  Bottom 0.406: 271.86,71.35 271.99,71.35 273.03,70.31 C87.+ 275.67,68.78 v279.5,64.95 | S19.5 301.21,72 301.86,71.35 | 301.86,71.35 301.86,68.05 301.1,67.29 299.32,67.29 298.05,66.02 298.05,63.73 | 298.05,63.73 297.54,63.22 293.98,63.22 293.1,62.33 IC29.8 | C108.+ 303.03,70.31 301.99,71.35 301.86,71.35 | S18.5 331.21,72 331.86,71.35 | 331.86,71.35 331.86,68.05 331.1,67.29 329.32,67.29 328.05,66.02 328.05,63.73 | 328.05,63.73 327.54,63.22 323.98,63.22 323.1,62.33 IC28.8 | C115.1 329.32,62.71 328.3,63.73 328.05,63.73 | C107.+ 333.03,70.31 331.99,71.35 331.86,71.35 | S23.5 241.21,22 241.86,21.35 | 241.86,21.35 241.86,18.05 241.1,17.29 239.32,17.29 238.05,16.02 238.05,13.73 | 238.05,13.73 237.54,13.22 233.98,13.22 233.09,12.33 IC33.8 | C138.1 239.32,12.71 238.3,13.73 238.05,13.73 | 241.86,21.35 241.99,21.35 243.03,20.31 C126.+ 245.86,20.12 v249.91,20.12 | S22.5 271.21,22 271.86,21.35 | 271.86,21.35 271.86,18.05 271.1,17.29 269.32,17.29 268.05,16.02 268.05,13.73 | 268.05,13.73 267.54,13.22 263.98,13.22 263.1,12.33 IC32.8 | C137.1 269.32,12.71 268.3,13.73 268.05,13.73 | 271.86,21.35 271.99,21.35 273.03,20.31 C125.+ 279.18,20.31 v279.25,20.25 | S21.5 301.21,22 301.86,21.35 | 301.86,21.35 301.86,18.05 301.1,17.29 299.32,17.29 298.05,16.02 298.05,13.73 | 298.05,13.73 297.54,13.22 293.98,13.22 293.1,12.33 IC31.8 | C136.1 299.32,12.71 298.3,13.73 298.05,13.73 | 301.86,21.35 301.99,21.35 303.03,20.31 C124.+ 307.5,20.31 v307.69,20.12 | S20.5 331.21,22 331.86,21.35 | 331.86,21.35 331.86,18.05 331.1,17.29 329.32,17.29 328.05,16.02 328.05,13.73 | 328.05,13.73 327.54,13.22 323.98,13.22 323.1,12.33 IC30.8
  Bottom 0.406: C135.1 329.32,12.71 328.3,13.73 328.05,13.73 | 331.86,21.35 331.99,21.35 333.03,20.31 C123.+ 342.05,20.31 344.01,18.34 347.82,18.34 C121.+ 347.89,22.62 348.33,23.06 C119.1 | IC27.8 271.35,113.36 270.02,114.7 270.02,119.14 D10.2 264,123.65 263.22,122.87 259.85,122.87 C120.1 258.33,123.06 257.89,122.62 C122.+ | IC26.8 361.35,13.36 360.02,14.7 360.02,19.14 D9.2 354,23.65 353.22,22.87 349.85,22.87 C119.1 | 151.35,98.36 IC21.8 151.35,96.19 150.21,95.05 136.24,95.05 135.61,95.68 135.61,102.92 136.24,103.56 | D8.2 144,108.65 143.22,107.87 139.85,107.87 C78.1 138.33,108.06 137.89,107.62 C82.+ 137.74,103.56 136.24,103.56 | IC20.8 201.35,98.36 199.89,99.82 199.89,104.27 D7.2 194,108.65 193.22,107.87 189.85,107.87 C77.1 188.33,108.06 187.89,107.62 C81.+ 183.21,103.4 v182.47,102.67 | IC19.8 151.35,28.36 150.02,29.7 150.02,34.14 D6.2 144,38.65 143.22,37.87 139.85,37.87 C76.1 138.33,38.06 137.89,37.62 C80.+ 127.86,33.4 | IC18.8 201.35,28.36 200.02,29.7 200.02,34.14 D5.2 194,38.65 193.22,37.87 189.85,37.87 C75.1 | C75.1 188.33,38.06 187.89,37.62 C79.+ 183.06,33.4 180.44,30.79 180.44,20.31 | 132.43,107.37 136.24,103.56 | 117.32,85.83 v117.32,74.73 | C116.1 299.32,62.46 298.05,63.73 | v335.63,67.11 335.63,70.27 C107.+ | C50.1 199.62,57.77 MCP_010.16 199.62,62.79 v199.11,63.3 199.05,63.3 194.54,67.81 MCP_010.9 194.54,75.11 195.43,76 R85.2 | v210.16,66.73 209.93,66.96 C49.+ 205.84,71.05 204.95,71.93 R84.2 | 127.86,33.4 117.02,33.4 v111.22,27.61 | 176.21,22 175.99,22.21 175.99,28.88 175.36,29.52 163.42,29.52 155.04,21.13 136.37,21.13 127.86,29.64 127.86,33.4
  Bottom 0.406: v35.66,47.55 35.66,50.85 R2.2 R1.2 37.06,57.71 40.23,60.88 | MCP_001.9 36.54,48.43 v35.66,47.55 | C85.1 261.53,96 261.72,95.81 MCP_011.16 | v261.72,93.02 MCP_011.16 | R130.2 R132.2 266.42,81.33 266.8,81.71 266.8,82.35 | 257.15,86.31 C83.+ 260.36,89.52 v261.78,89.52 265.47,89.52 266.8,88.19 MCP_011.9 266.8,82.35 | v286.23,45.39 286.17,45.33 C86.1 284,44.63 MCP_100.17 | v279.75,59.62 v279.75,54.53 279.75,54.15 277.34,51.74 C84.+ 271.12,51.74 | 271.12,51.74 267.56,51.74 267.18,51.36 R131.2 | 271.12,51.74 R133.2 | MCP_100.9 v276.07,40.82 | C119.1 349.67,56.31 C107.+ | MCP_011.16 MCP_011.15 | 81.86,119.81 81.86,119.21 78.05,115.4 78.05,115.01 76.26,113.22 75.14,113.22 73.09,111.18 IC3.8 | 132.43,107.37 127.82,102.75 109.91,102.75 104.81,97.65 | v37.69,98.48 v37.69,84.38 | v127.73,35.99 127.86,35.87 127.86,33.4 | v151.48,86.41 117.9,86.41 117.32,85.83
DATA_PIXEL11  (via drill 0.35)
  Top 0.305: v17.88,110.54 16.74,109.4 11.71,109.4 11.07,108.75 11.07,86.75 20.17,77.65 20.17,67.87 15.59,63.3 v15.59,62.28
  Bottom 0.305: IC4.5 16.94,110.54 v17.88,110.54 | v15.59,62.28 15.59,60.55 IC8.6
DATA_PIXEL12  (via drill 0.35)
  Top 0.305: v27.28,111.56 23.34,111.56 22.32,112.57 15.85,112.57 v15.59,112.32
  Bottom 0.305: v15.59,112.32 15.63,112.28 IC4.6 | IC1.5 55.16,110.93 54.22,110 28.84,110 v27.28,111.56
DATA_PIXEL13  (via drill 0.35)
  Top 0.305: v78.33,110.54 60.93,110.54 56.74,114.73 v54.07,114.73
  Bottom 0.305: IC3.5 78.3,110.51 v78.33,110.54 | v54.07,114.73 54.07,114.48 53.82,114.22 53.82,112.99 IC1.6
DATA_PIXEL14  (via drill 0.35)
  Top 0.305: v83.67,109.53 86.71,112.57 v106.91,112.57
  Bottom 0.305: v106.91,112.57 IC2.5 | IC3.6 75.64,111.4 76.43,112.19 80.36,112.19 83.03,109.53 v83.67,109.53
DATA_PIXEL21  (via drill 0.35)
  Top 0.305: v19.28,60.5 26.9,60.5 35.15,68.76 49.5,68.76 v53.95,64.31
  Bottom 0.305: IC8.5 19.27,60.51 v19.28,60.5 | v53.95,64.31 53.89,64.26 IC7.6
DATA_PIXEL22  (via drill 0.35)
  Top 0.305: v62.46,61.77 65.25,58.98 75.54,58.98 v75.66,59.11
  Bottom 0.305: IC7.5 61.31,62.92 v62.46,61.77 | v75.66,59.11 75.64,59.14 IC6.6
DATA_PIXEL23  (via drill 0.35)
  Top 0.305: v82.52,60.5 97.64,60.5 99.16,58.98 105.38,58.98 v105.64,59.23
  Bottom 0.305: IC6.5 82.52,60.51 v82.52,60.5 | v105.64,59.23 IC5.6
DATA_PIXEL24  (via drill 0.35)
  Top 0.305: v112.24,60.12 112.24,19.99 105.64,13.39 v105.64,12.12
  Bottom 0.305: IC5.5 111.85,60.51 v112.24,60.12 | v105.64,12.12 IC9.6
DATA_PIXEL32  (via drill 0.35)
  Top 0.305: v30.96,11.36 20.55,11.36 19.66,12.24 15.85,12.24 v15.59,11.99
  Bottom 0.305: IC12.5 45.16,14.17 44.42,14.91 41.12,14.91 40.17,13.96 40.17,12.05 39.47,11.36 v30.96,11.36 | v15.59,11.99 15.63,11.95 IC13.6
DATA_PIXEL33
  Bottom 0.305: IC11.5 65.16,11.9 63.34,10.07 46.53,10.07 43.89,12.71 IC12.6
DATA_PIXEL34  (via drill 0.35)
  Top 0.305: v63.98,11.48 64.87,10.59 v78.08,10.59
  Bottom 0.305: IC10.5 78,10.51 v78.08,10.59 | v63.98,11.48 63.89,11.57 IC11.6
DATA_PIXEL35  (via drill 0.35)
  Top 0.305: v108.3,10.59 100.3,10.59 96.75,14.15 84.43,14.15 83.16,12.88 76.43,12.88 v75.66,12.12
  Bottom 0.305: IC9.5 106.99,10.59 v108.3,10.59 | v75.66,12.12 75.66,10.54 IC10.6
GND  (via drill 0.35)
  Top 0.406: S1.C | v49.38,49.96 49.12,49.71 v40.99,49.71 36.8,49.71 35.41,51.11 35.41,56.82 | v87.47,77.9 89.89,80.32 v100.17,80.32 v100.17,82.35 100.17,83.36 99.41,84.13 94.59,84.13 92.94,85.78 92.94,92.25 92.17,93.02 | v94.59,93.02 92.17,93.02 | 92.17,93.02 90.4,93.02 88.24,95.17 88.24,95.43 87.6,95.43 85.82,97.21 85.82,105.84 84.81,106.86 v84.05,106.86 95.6,106.86 v95.73,106.73 | SW2.1 36.94,67.25 35.91,66.22 35.91,56.82 35.41,56.82 | v24.99,56.82 35.41,56.82 | SW4.1 33.5,15.5 33.5,10.09 32.36,8.94 15.47,8.94 15,8.48 S9.C | v71.98,49.33 77.31,43.99 v77.31,31.55 | 75,107.85 S2.C 65.13,97.63 24.87,97.63 S3.C | v47.98,18.98 47.98,19.74 48.23,19.99 50.52,19.99 51.75,18.76 SW3.1 | SW5.1 183.87,32.25 | 183.87,32.25 172.88,32.25 169.9,35.23 | 169.9,35.23 169.9,37.4 S12.C | 183.87,32.25 183.87,10.72 178.53,5.38 172.12,5.38 | 172.12,5.38 S13.C | 172.12,5.38 158.22,5.38 144.88,18.72 144.88,29.12 SW6.1 | SW7.2 198.38,102.25 198.98,101.65 v204.19,101.65 | v195.43,74.73 176.38,74.73 v176.12,74.47 | 169.9,35.23 163.8,35.23 158.01,29.44 v156.74,29.44 | v127.86,110.29 133.71,110.29 SW8.1 | v265.27,82.6 v265.27,80.06
  Bottom 0.406: MCP_000.17 MCP_000.16 | MCP_000.16 MCP_000.15 101.19,86.01 101.19,87.94 102.31,89.05 C1.2 106.81,89.05 109.01,86.85 C2.- | IC3.4 76.91,114.62 76.52,114.24 73.22,114.24 71.19,112.21 71.19,110.17 | 73.98,108.9 72.46,108.9 71.19,110.17 | 73.98,108.9 75,107.89 S2.C | 66.87,115.11 66.87,125.41 67.89,126.43 R22.2 69.06,127.34 69.62,127.9 80.38,127.9 C13.2 | 66.87,115.11 66.87,112.97 | 66.87,112.97 69.67,110.17 71.19,110.17 | 66.87,112.97 66.87,107.06 C8.1 | 73.98,108.9 81.86,108.9 82.87,107.89 82.87,106.86 | 82.87,106.86 C9.1 | IC2.4 106.91,114.62 106.52,114.24 103.22,114.24 101.19,112.21 101.19,110.17 | 103.98,108.9 102.46,108.9 101.19,110.17 | 103.98,108.9 105,107.89 S1.C | 96.87,112.97 99.67,110.17 101.19,110.17 | 100.2,127.47 R18.2 98.64,126.43 96.87,124.66 96.87,112.97 | 96.87,112.97 96.87,107.06 C6.1 97.05,106.73 v95.73,106.73 | IC8.4 16.91,64.62 16.52,64.24 13.22,64.24 11.14,62.16 9.24,62.16 8.63,61.54 C48.2 | 15,57.89 S6.C 15,58.82 15.03,58.85 | 6.87,60.38 6.87,73.13 7.89,74.14 R51.2 10.2,75.18 11.44,76.43 C29.2 | 6.87,60.38 6.87,57.06 C25.1 | IC6.4 76.91,64.62 76.52,64.24 73.22,64.24 71.14,62.16 68.68,62.16 68.32,61.8 C31.2 | 66.87,66.73 66.87,73.13 67.89,74.14 R47.2 70.2,75.18 71.44,76.43 C28.2 77.35,77.69 77.57,77.9 v87.47,77.9 | 66.87,66.73 66.87,60.5 | IC5.4 106.91,64.62 106.52,64.24 103.22,64.24 101.7,62.71 97.76,62.71 | R43.2 97.89,74.14 96.87,73.13 96.87,62.97 97.13,62.71 97.76,62.71 | C27.2 101.44,76.43 100.2,75.18 R43.2 | IC13.4 16.91,14.62 16.52,14.24 12.63,14.24 11.15,12.75 8.48,12.75 7.87,12.14 | 13.98,8.9 15,7.89 S9.C 15,5.23 14.35,4.58 C40.1 | C44.2 11.44,26.43 10.2,25.18 R77.2 7.89,24.14 6.87,23.13 6.87,12.97 7.7,12.14 7.87,12.14
  Bottom 0.406: 13.98,8.9 21.86,8.9 22.87,7.89 C41.1 | 71.19,12.21 73.22,14.24 76.52,14.24 76.91,14.62 IC10.4 76.91,16.91 77.06,17.07 82.39,17.07 82.78,17.45 82.78,18.62 C16.2 | 73.98,8.9 72.46,8.9 71.19,10.17 71.19,12.21 | 73.98,8.9 75,7.89 S8.C | 66.87,16.43 66.87,23.13 67.89,24.14 R73.2 70.2,25.18 71.44,26.43 C43.2 77.31,26.47 v77.31,31.55 | 66.87,16.43 66.87,12.97 | 66.87,12.97 67.63,12.21 71.19,12.21 | 66.87,12.97 66.87,11.12 C38.1 | 101.19,10.17 101.19,12.21 103.22,14.24 106.52,14.24 106.91,14.62 IC9.4 108.19,17.22 C45.2 | 101.19,10.17 102.46,8.9 103.98,8.9 105,7.89 S7.C 105,7.42 106.27,6.15 109.42,6.15 C37.1 | 96.87,12.97 96.87,23.13 97.89,24.14 R69.2 100.2,25.18 101.44,26.43 C42.2 | 96.87,12.97 99.67,10.17 101.19,10.17 | 96.87,12.97 C36.1 92.58,10.74 92.56,10.72 91.92,11.36 89.89,11.36 | SW1.1 43.31,118.81 C5.1 44.05,119.69 44.83,120.47 46.57,120.47 48.25,118.79 SW1.2 48.88,116.61 54.5,116.61 55.16,117.27 IC1.4 55.71,118.9 C46.2 63.09,118.9 66.87,115.11 | SW2.1 43.31,68.81 C20.1 44.05,69.69 44.83,70.47 46.57,70.47 48.25,68.79 SW2.2 48.88,66.61 54.5,66.61 55.16,67.27 IC7.4 57.13,68.35 C32.2 58.67,68.23 60.28,66.61 66.76,66.61 66.87,66.73 | SW3.1 53.31,18.81 C34.1 54.05,19.7 54.83,20.47 56.57,20.47 58.25,18.79 SW3.2 58.88,16.61 64.5,16.61 | IC11.4 65.16,17.27 64.5,16.61 | IC12.4 45.16,17.27 44.5,16.61 | 44.5,16.61 38.88,16.61 SW4.2 38.25,18.79 36.57,20.47 34.83,20.47 34.05,19.7 C35.1 33.31,18.81 SW4.1 31.16,16.66 C18.2 | C22.1 105,55.57 | 105,55.57 S4.C 105,57.89 103.98,58.9 99.23,58.9 98.78,59.36 98.78,60.27 C30.2 98.42,62.05 97.76,62.71 | C21.1 105,55.57
  Bottom 0.406: C24.1 75,55.19 S5.C 75,57.89 73.98,58.9 69.62,58.9 69.57,58.85 68.81,58.85 68.32,59.34 C31.2 | C23.1 66.87,57.06 66.87,60.5 | C11.1 22.87,107.46 21.27,109.06 16.56,109.06 S3.C | 14.62,107.5 S3.C | IC4.4 16.91,115.49 15.8,114.39 12.78,114.39 9.6,111.2 9.47,111.2 7.42,109.14 | C10.1 7.13,108.86 7.42,109.14 | S3.C 13.36,109.14 7.42,109.14 | 23.29,106.81 C11.1 | 44.5,16.61 47.55,16.61 C15.2 v47.98,18.98 | 64.5,16.61 66.69,16.61 66.87,16.43 | v49.38,49.96 49.63,50.22 49.63,52.88 50.26,53.51 MCP_001.16 MCP_001.17 53.45,52.24 53.79,52.58 C4.2 58.82,52.58 60.8,50.6 60.8,49.11 C3.- 71.76,49.11 v71.98,49.33 | v40.99,49.71 MCP_001.10 | R43.2 100.2,80.29 v100.17,80.32 | v100.17,82.35 100.17,83.87 99.79,84.25 99.79,85.88 MCP_000.16 | 73.98,8.9 78.17,8.9 80.64,11.38 83.28,11.38 | 83.28,11.38 C39.1 89.86,11.38 89.89,11.36 | 83.28,11.38 83.31,11.36 89.89,11.36 | 100.16,127.43 100.2,127.47 | MCP_000.10 96.04,93.58 95.48,93.02 v94.59,93.02 | 82.87,106.86 v84.05,106.86 85.44,106.86 86.46,107.88 86.46,112.83 85.55,113.74 C47.2 | v24.99,56.82 24.98,56.81 C26.1 22.87,57.67 21.69,58.85 15.03,58.85 | 13.98,8.9 8.52,8.9 7.87,9.55 C17.2 7.87,12.14 | C31.2 66.87,60.5 | C48.2 8.51,60.38 6.87,60.38 | C48.2 8.63,59.08 8.81,58.9 15.09,58.9 15.03,58.85 | C11.1 24.81,106.81 25.35,107.34 C33.2 25.35,126.82 24.59,127.58 C14.2 21.88,127.79 11.55,127.79 R26.2 | IC14.4 171.91,114.62 171.52,114.24 168.22,114.24 166.19,112.21 166.19,112.08 | 166.19,112.08 166.19,110.17 167.33,109.03 168.86,109.03 170,107.89 S10.C 170,108.02 170.89,108.9 171.2,108.9 171.38,108.73 173.38,108.73 174.32,109.67 C63.2 174.38,109.92 175.72,109.92 176.42,110.62 C56.1 176.42,112.65 177.11,113.35 180.01,113.35 C51.-
  Bottom 0.406: 165.2,125.18 165.2,124.91 | 165.2,124.91 R101.2 163.14,124.4 161.87,123.13 161.87,113.86 | 161.87,113.86 161.87,110.49 C55.1 160.11,110.43 159.99,110.54 158.21,108.76 158.21,104.32 157.24,103.35 IC21.4 155.16,102.42 | 161.87,113.86 163.14,112.59 165.68,112.59 166.19,112.08 | C67.2 165.24,124.95 165.2,124.91 | IC15.4 171.91,84.62 171.52,84.24 168.22,84.24 166.19,82.21 166.19,82.08 | S11.C 170,77.89 168.98,78.9 167.46,78.9 166.19,80.17 166.19,82.08 | 163.14,94.4 R105.2 165.2,94.91 | 163.14,94.4 161.87,93.13 161.87,83.86 | 163.14,94.4 163.16,94.42 155.16,102.42 | 165.2,95.18 165.2,94.91 | C57.1 161.87,80.49 161.87,83.86 | 161.87,83.86 163.14,82.59 165.68,82.59 166.19,82.08 | S11.C 170,78.02 170.89,78.9 173.56,78.9 174.32,79.67 C64.2 174.38,79.92 175.72,79.92 176.42,80.62 C58.1 176.42,82.65 177.11,83.35 180.01,83.35 C52.- | C68.2 165.24,94.95 165.2,94.91 | IC16.4 171.91,44.62 171.52,44.24 168.22,44.24 166.19,42.21 166.19,42.08 | 166.19,42.08 166.19,40.17 167.46,38.9 168.98,38.9 170,37.89 S12.C 170,38.02 170.89,38.9 173.56,38.9 174.32,39.67 C65.2 174.38,39.92 175.72,39.92 176.42,40.62 C60.1 176.42,42.65 177.11,43.35 180.01,43.35 C53.- | 165.2,55.18 165.2,54.91 | 165.2,54.91 R109.2 163.14,54.4 161.87,53.13 161.87,43.86 | C59.1 161.87,40.49 161.87,43.86 | 161.87,43.86 163.14,42.59 165.68,42.59 166.19,42.08 | 165.2,54.91 165.24,54.95 C69.2 165.24,71.59 170,76.35 | IC17.4 171.91,14.62 171.52,14.24 168.22,14.24 166.19,12.21 166.19,12.08 | 166.19,12.08 166.19,10.17 167.46,8.9 168.98,8.9 170,7.89 S13.C 170,8.02 170.89,8.9 173.56,8.9 174.32,9.67 C66.2 174.38,9.92 175.72,9.92 176.42,10.62 C62.1 176.42,12.65 177.11,13.35 180.01,13.35 C54.-
  Bottom 0.406: 165.2,25.18 165.2,24.91 | 165.2,24.91 R113.2 163.14,24.4 161.87,23.13 161.87,13.86 | C61.1 161.87,10.49 161.87,13.86 | 161.87,13.86 163.14,12.59 165.68,12.59 166.19,12.08 | C70.2 165.24,24.95 165.2,24.91 | IC25.4 236.91,114.62 236.52,114.24 233.22,114.24 231.19,112.21 231.19,112.08 | 231.19,112.08 231.19,110.17 232.46,108.9 233.98,108.9 235,107.89 S17.C 235,108.02 235.89,108.9 238.56,108.9 239.32,109.67 C102.2 239.38,109.92 240.72,109.92 241.42,110.62 C98.1 241.42,112.65 242.11,113.35 245.01,113.35 C90.- 245.67,113.26 246.82,112.1 C122.- | 230.2,125.18 230.2,124.91 | 230.2,124.91 R161.2 228.14,124.4 226.87,123.13 226.87,113.86 | 226.87,113.86 226.87,110.49 C97.1 225.92,110.43 224.65,109.16 211.94,109.16 206.21,103.43 205.33,103.43 205.2,103.3 IC20.4 205.16,102.24 204.57,101.65 v204.19,101.65 | 226.87,113.86 228.14,112.59 230.68,112.59 231.19,112.08 | C106.2 230.24,124.95 230.2,124.91 | IC24.4 296.9,114.62 296.52,114.24 293.22,114.24 291.19,112.21 291.19,112.08 | 291.19,112.08 291.19,110.17 292.46,108.9 293.98,108.9 295,107.89 S16.C 295,108.02 295.89,108.9 298.56,108.9 299.32,109.67 C101.2 299.38,109.92 300.71,109.92 301.42,110.62 C96.1 301.42,112.65 302.11,113.35 305.01,113.35 C89.- 320.24,99.44 C117.2 320.24,74.95 320.2,74.91 | 290.2,125.18 290.2,124.91 | 290.2,124.91 R157.2 288.14,124.4 286.87,123.13 286.87,113.86 | 286.87,113.86 286.87,110.49 C95.1 284.28,113.08 276.68,113.08 | 286.87,113.86 288.14,112.59 290.68,112.59 291.19,112.08 | C105.2 290.24,124.95 290.2,124.91 | IC23.4 236.91,64.62 236.52,64.24 233.22,64.24 231.19,62.21 231.19,62.08
  Bottom 0.406: 231.19,62.08 231.19,60.17 232.46,58.9 233.98,58.9 235,57.89 S15.C 235,58.02 235.89,58.9 238.56,58.9 239.32,59.67 C100.2 239.38,59.92 240.72,59.92 241.42,60.62 C94.1 241.42,62.65 242.11,63.35 245.01,63.35 | 230.2,75.18 230.2,74.91 | 230.2,74.91 R153.2 228.14,74.4 226.87,73.13 226.87,63.86 | 226.87,63.86 226.87,60.49 C93.1 226.71,60.66 | 226.87,63.86 228.14,62.59 230.68,62.59 231.19,62.08 | C104.2 230.24,74.95 230.2,74.91 | C88.- 245.01,63.35 | IC22.4 266.9,64.62 266.52,64.24 263.22,64.24 261.19,62.21 261.19,62.08 | 261.19,62.08 261.19,60.17 262.46,58.9 263.98,58.9 265,57.89 S14.C 265,58.02 265.89,58.9 268.56,58.9 269.32,59.67 C99.2 269.38,59.92 270.71,59.92 271.42,60.62 C92.1 271.42,62.65 272.11,63.35 275.01,63.35 C87.- 279.18,60.49 281.66,60.49 | 260.2,75.18 260.2,74.91 | 260.2,74.91 R149.2 258.14,74.4 256.87,73.13 256.87,63.86 | 256.87,63.86 256.87,60.49 C91.1 256.44,60.43 254.9,58.9 248.26,58.9 245.01,62.15 245.01,63.35 | 256.87,63.86 258.14,62.59 260.68,62.59 261.19,62.08 | 260.2,74.91 260.24,74.95 C103.2 262.4,78.97 264.18,78.97 v265.27,80.06 | IC29.4 296.9,64.62 296.52,64.24 293.22,64.24 291.19,62.21 291.19,62.08 | S19.C 295,57.89 293.98,58.9 292.46,58.9 291.19,60.17 291.19,62.08 | 290.2,75.18 290.2,74.91 | 290.2,74.91 R177.2 288.14,74.4 286.87,73.13 286.87,63.86 | 286.87,60.49 C111.1 | 286.87,63.86 286.87,60.49 | 286.87,63.86 288.14,62.59 290.68,62.59 291.19,62.08 | S19.C 295,58.02 295.89,58.9 298.56,58.9 299.32,59.67 C116.2 299.38,59.92 300.71,59.92 301.42,60.62 C112.1 301.42,62.65 302.11,63.35 305.01,63.35 C108.- 309.22,60.45 316.91,60.45
  Bottom 0.406: C118.2 290.24,74.95 290.2,74.91 | IC28.4 326.9,64.62 326.52,64.24 323.22,64.24 321.19,62.21 321.19,62.08 | S18.C 325,57.89 323.98,58.9 322.46,58.9 321.19,60.17 321.19,62.08 | 320.2,75.18 320.2,74.91 | 320.2,74.91 R173.2 318.14,74.4 316.87,73.13 316.87,63.86 | 316.91,60.45 316.87,60.49 316.87,63.86 | 316.91,60.45 C109.1 | 316.87,63.86 318.14,62.59 320.68,62.59 321.19,62.08 | S18.C 325,58.02 325.89,58.9 328.56,58.9 329.32,59.67 C115.2 329.38,59.92 330.71,59.92 331.42,60.62 C110.1 331.42,62.65 332.11,63.35 335.01,63.35 C107.- | IC33.4 236.91,14.62 236.52,14.24 233.22,14.24 231.19,12.21 231.19,12.08 | 231.19,12.08 231.19,10.17 232.46,8.9 233.98,8.9 235,7.89 S23.C 235,8.02 235.89,8.9 238.56,8.9 239.32,9.67 C138.2 239.38,9.92 240.72,9.92 241.42,10.62 C134.1 241.42,12.65 242.11,13.35 245.01,13.35 C126.- 249.25,10.43 C131.1 256.87,10.49 256.87,13.86 | 230.2,25.18 230.2,24.91 | 230.2,24.91 R211.2 228.14,24.4 226.87,23.13 226.87,13.86 | C133.1 226.87,10.49 226.87,13.86 | 226.87,13.86 228.14,12.59 230.68,12.59 231.19,12.08 | C142.2 230.24,24.95 230.2,24.91 | IC32.4 266.9,14.62 266.52,14.24 263.22,14.24 261.19,12.21 261.19,12.08 | 261.19,12.08 261.19,10.17 262.46,8.9 263.98,8.9 265,7.89 S22.C 265,8.02 265.89,8.9 268.56,8.9 269.32,9.67 C137.2 269.38,9.92 270.71,9.92 271.42,10.62 C132.1 271.42,12.65 272.11,13.35 275.01,13.35 C125.- 279.25,10.43 C129.1 286.87,10.49 286.87,13.86 | 260.2,25.18 260.2,24.91 | 260.2,24.91 R207.2 258.14,24.4 256.87,23.13 256.87,13.86 | 256.87,13.86 258.14,12.59 260.68,12.59 261.19,12.08 | C141.2 260.24,26.59 | 260.24,26.59 260.24,24.95 260.2,24.91
  Bottom 0.406: IC31.4 296.9,14.62 296.52,14.24 293.22,14.24 291.19,12.21 291.19,12.08 | 291.19,12.08 291.19,10.17 292.46,8.9 293.98,8.9 295,7.89 S21.C 295,8.02 295.89,8.9 298.56,8.9 299.32,9.67 C136.2 299.38,9.92 300.71,9.92 301.42,10.62 C130.1 301.42,12.65 302.11,13.35 305.01,13.35 C124.- 309.25,10.43 C127.1 316.87,10.49 316.87,13.86 | 290.2,25.18 290.2,24.91 | 290.2,24.91 R203.2 288.14,24.4 286.87,23.13 286.87,13.86 | 286.87,13.86 288.14,12.59 290.68,12.59 291.19,12.08 | C140.2 290.24,26.47 | 290.24,26.47 290.24,24.95 290.2,24.91 | IC30.4 326.9,14.62 326.52,14.24 323.22,14.24 321.19,12.21 321.19,12.08 | 321.19,12.08 321.19,10.17 322.46,8.9 323.98,8.9 325,7.89 S20.C 325,8.02 325.89,8.9 328.56,8.9 329.32,9.67 C135.2 329.38,9.92 330.71,9.92 331.42,10.62 C128.1 331.42,12.65 332.11,13.35 335.01,13.35 C123.- 337.57,12.1 C121.- 347.89,13.39 SW9.1 353.31,18.81 C113.1 354.05,19.7 354.83,20.47 | 320.2,25.18 320.2,24.91 | 320.2,24.91 R199.2 318.14,24.4 316.87,23.13 316.87,13.86 | 316.87,13.86 318.14,12.59 320.68,12.59 321.19,12.08 | 320.2,24.91 320.24,24.95 C139.2 320.24,38.76 325,43.52 325,54.66 | 264.83,120.47 266.57,120.47 268.25,118.79 SW10.2 268.25,115.05 269.83,113.48 269.83,112.21 270.84,111.19 275.67,111.19 276.68,112.21 276.68,113.08 | 264.83,120.47 264.05,119.69 C114.1 263.31,118.81 SW10.1 257.89,113.39 C122.- | 276.68,113.08 276.68,114.49 275.16,116.02 IC27.4 | C120.2 260.35,120.47 264.83,120.47 | 354.83,20.47 356.57,20.47 358.25,18.79 SW9.2 358.25,15.05 359.83,13.48 359.83,12.21 360.84,11.19 365.67,11.19 366.68,12.21 366.68,14.49 365.16,16.02 IC26.4